# Altium schematic sheet 0013_Processor - DISPLA.SchDoc
size A3
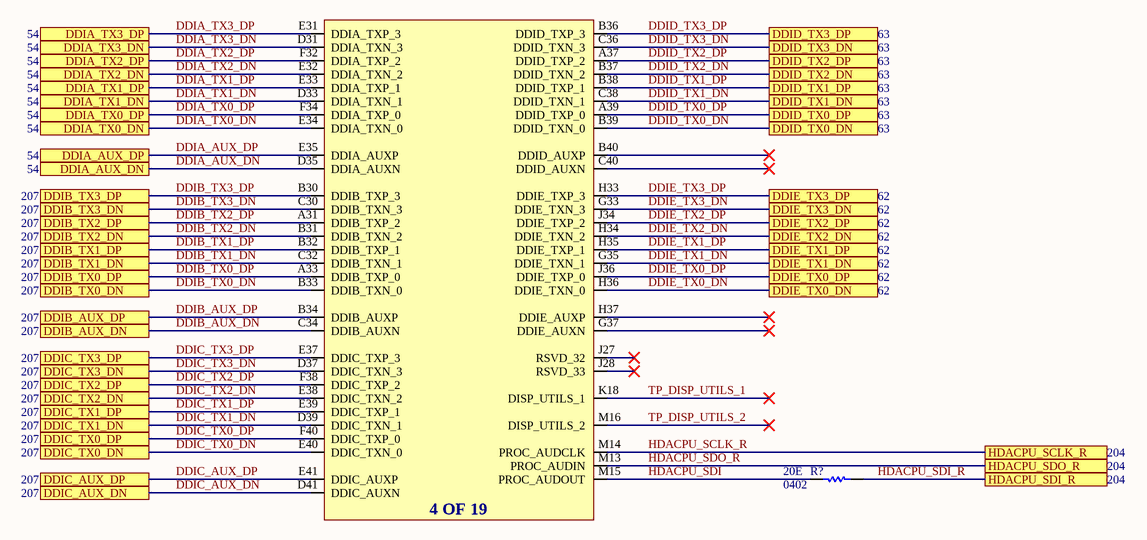
[diagram p0: 0013_Processor - DISPLA.SchDoc]

## Parts
R?  value 20E  Case/Package: 0402  [RESC0402]  (hidden comment: Res)
U1401  C_RPL_HX_EXT  (value not drawn)  (part D of 19)

## Ports
DDIA_AUX_DN, DDIA_AUX_DP, DDIA_TX0_DN, DDIA_TX0_DP, DDIA_TX1_DN, DDIA_TX1_DP, DDIA_TX2_DN, DDIA_TX2_DP, DDIA_TX3_DN, DDIA_TX3_DP, DDIB_AUX_DN, DDIB_AUX_DP, DDIB_TX0_DN, DDIB_TX0_DP, DDIB_TX1_DN, DDIB_TX1_DP, DDIB_TX2_DN, DDIB_TX2_DP, DDIB_TX3_DN, DDIB_TX3_DP, DDIC_AUX_DN, DDIC_AUX_DP, DDIC_TX0_DN, DDIC_TX0_DP, DDIC_TX1_DN, DDIC_TX1_DP, DDIC_TX2_DN, DDIC_TX2_DP, DDIC_TX3_DN, DDIC_TX3_DP, DDID_TX0_DN, DDID_TX0_DP, DDID_TX1_DN, DDID_TX1_DP, DDID_TX2_DN, DDID_TX2_DP, DDID_TX3_DN, DDID_TX3_DP, DDIE_TX0_DN, DDIE_TX0_DP, DDIE_TX1_DN, DDIE_TX1_DP, DDIE_TX2_DN, DDIE_TX2_DP, DDIE_TX3_DN, DDIE_TX3_DP, HDACPU_SCLK_R, HDACPU_SDI_R, HDACPU_SDO_R

## Nets
DDIA_AUX_DN: U1401.D35(DDIA_AUXN) ; port DDIA_AUX_DN
DDIA_AUX_DP: U1401.E35(DDIA_AUXP) ; port DDIA_AUX_DP
DDIA_TX0_DN: U1401.E34(DDIA_TXN_0) ; port DDIA_TX0_DN
DDIA_TX0_DP: U1401.F34(DDIA_TXP_0) ; port DDIA_TX0_DP
DDIA_TX1_DN: U1401.D33(DDIA_TXN_1) ; port DDIA_TX1_DN
DDIA_TX1_DP: U1401.E33(DDIA_TXP_1) ; port DDIA_TX1_DP
DDIA_TX2_DN: U1401.E32(DDIA_TXN_2) ; port DDIA_TX2_DN
DDIA_TX2_DP: U1401.F32(DDIA_TXP_2) ; port DDIA_TX2_DP
DDIA_TX3_DN: U1401.D31(DDIA_TXN_3) ; port DDIA_TX3_DN
DDIA_TX3_DP: U1401.E31(DDIA_TXP_3) ; port DDIA_TX3_DP
DDIB_AUX_DN: U1401.C34(DDIB_AUXN) ; port DDIB_AUX_DN
DDIB_AUX_DP: U1401.B34(DDIB_AUXP) ; port DDIB_AUX_DP
DDIB_TX0_DN: U1401.B33(DDIB_TXN_0) ; port DDIB_TX0_DN
DDIB_TX0_DP: U1401.A33(DDIB_TXP_0) ; port DDIB_TX0_DP
DDIB_TX1_DN: U1401.C32(DDIB_TXN_1) ; port DDIB_TX1_DN
DDIB_TX1_DP: U1401.B32(DDIB_TXP_1) ; port DDIB_TX1_DP
DDIB_TX2_DN: U1401.B31(DDIB_TXN_2) ; port DDIB_TX2_DN
DDIB_TX2_DP: U1401.A31(DDIB_TXP_2) ; port DDIB_TX2_DP
DDIB_TX3_DN: U1401.C30(DDIB_TXN_3) ; port DDIB_TX3_DN
DDIB_TX3_DP: U1401.B30(DDIB_TXP_3) ; port DDIB_TX3_DP
DDIC_AUX_DN: U1401.D41(DDIC_AUXN) ; port DDIC_AUX_DN
DDIC_AUX_DP: U1401.E41(DDIC_AUXP) ; port DDIC_AUX_DP
DDIC_TX0_DN: U1401.E40(DDIC_TXN_0) ; port DDIC_TX0_DN
DDIC_TX0_DP: U1401.F40(DDIC_TXP_0) ; port DDIC_TX0_DP
DDIC_TX1_DN: U1401.D39(DDIC_TXN_1) ; port DDIC_TX1_DN
DDIC_TX1_DP: U1401.E39(DDIC_TXP_1) ; port DDIC_TX1_DP
DDIC_TX2_DN: U1401.E38(DDIC_TXN_2) ; port DDIC_TX2_DN
DDIC_TX2_DP: U1401.F38(DDIC_TXP_2) ; port DDIC_TX2_DP
DDIC_TX3_DN: U1401.D37(DDIC_TXN_3) ; port DDIC_TX3_DN
DDIC_TX3_DP: U1401.E37(DDIC_TXP_3) ; port DDIC_TX3_DP
DDID_TX0_DN: U1401.B39(DDID_TXN_0) ; port DDID_TX0_DN
DDID_TX0_DP: U1401.A39(DDID_TXP_0) ; port DDID_TX0_DP
DDID_TX1_DN: U1401.C38(DDID_TXN_1) ; port DDID_TX1_DN
DDID_TX1_DP: U1401.B38(DDID_TXP_1) ; port DDID_TX1_DP
DDID_TX2_DN: U1401.B37(DDID_TXN_2) ; port DDID_TX2_DN
DDID_TX2_DP: U1401.A37(DDID_TXP_2) ; port DDID_TX2_DP
DDID_TX3_DN: U1401.C36(DDID_TXN_3) ; port DDID_TX3_DN
DDID_TX3_DP: U1401.B36(DDID_TXP_3) ; port DDID_TX3_DP
DDIE_TX0_DN: U1401.H36(DDIE_TXN_0) ; port DDIE_TX0_DN
DDIE_TX0_DP: U1401.J36(DDIE_TXP_0) ; port DDIE_TX0_DP
DDIE_TX1_DN: U1401.G35(DDIE_TXN_1) ; port DDIE_TX1_DN
DDIE_TX1_DP: U1401.H35(DDIE_TXP_1) ; port DDIE_TX1_DP
DDIE_TX2_DN: U1401.H34(DDIE_TXN_2) ; port DDIE_TX2_DN
DDIE_TX2_DP: U1401.J34(DDIE_TXP_2) ; port DDIE_TX2_DP
DDIE_TX3_DN: U1401.G33(DDIE_TXN_3) ; port DDIE_TX3_DN
DDIE_TX3_DP: U1401.H33(DDIE_TXP_3) ; port DDIE_TX3_DP
HDACPU_SCLK_R: U1401.M14(PROC_AUDCLK) ; port HDACPU_SCLK_R
HDACPU_SDI: R?.1 U1401.M15(PROC_AUDOUT)
HDACPU_SDI_R: R?.2 ; port HDACPU_SDI_R
HDACPU_SDO_R: U1401.M13(PROC_AUDIN) ; port HDACPU_SDO_R
TP_DISP_UTILS_1: U1401.K18(DISP_UTILS_1)
TP_DISP_UTILS_2: U1401.M16(DISP_UTILS_2)

Not connected (* = marked no-connect by the designer): U1401 B40(DDID_AUXP)* C40(DDID_AUXN)* G37(DDIE_AUXN)* H37(DDIE_AUXP)* J27(RSVD_32)* J28(RSVD_33)*

## Notes on the sheet
- (in symbol C_RPL_HX_EXT, part D) 4 OF 19

## Library data of the parts
R? = Res: Thick Film Resistor -  20ohm, 1%, 0402